# Altium schematic sheet IMU_9K_REV_E.SchDoc
size A4; DrawnBy: Philip Rowse
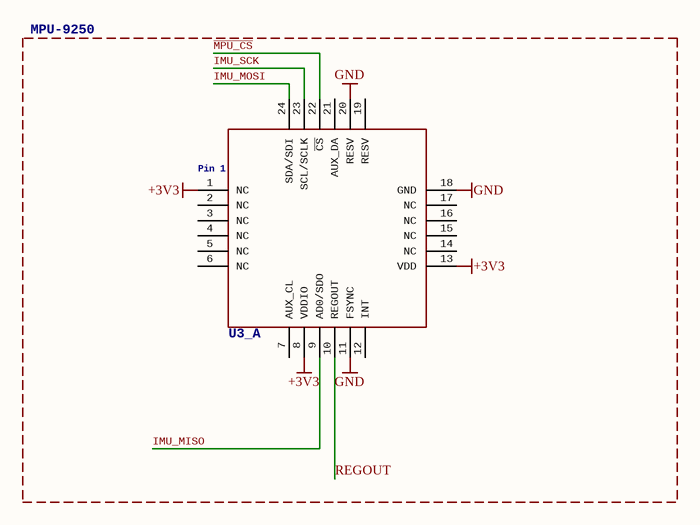
[diagram p0: IMU_9K_REV_E.SchDoc]

## Parts
U3_A  MPU-9250  [MPU-9250]

## Nets
+3V3: U3_A.1(NC) U3_A.8(VDDIO) U3_A.13(VDD)
GND: U3_A.11(FSYNC) U3_A.18(GND) U3_A.20(RESV)
IMU_MISO: U3_A.9(AD0/SDO)
IMU_MOSI: U3_A.24(SDA/SDI)
IMU_SCK: U3_A.23(SCL/SCLK)
~{MPU_CS}: U3_A.22(~{CS})
REGOUT: U3_A.10(REGOUT)

Not connected (* = marked no-connect by the designer): U3_A 2(NC) 3(NC) 4(NC) 5(NC) 6(NC) 7(AUX_CL) 12(INT) 14(NC) 15(NC) 16(NC) 17(NC) 19(RESV) 21(AUX_DA)

## Notes on the sheet
- http://www.oshwa.org/
- http://creativecommons.org/licenses/by-sa/3.0/
- Title:
- Date:
- Time:
- Sheet:
- Approved:
- of:
- Drawn By:
- Checked By:
- 3DRobotics

## Library data of the parts
U3_A = MPU-6500: PARTNO: MPU-9250; Pin 1: Pin 1